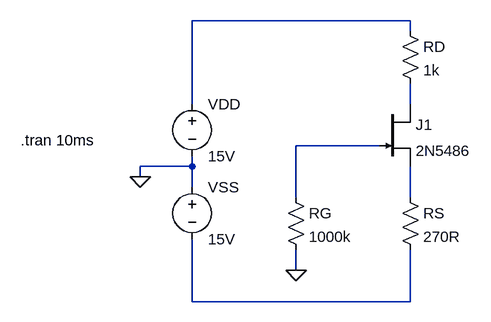
[diagram p0: schematic jfet-polarization-source-double.asc]
jfet-polarization-source-double.asc, the LTspice schematic file:
Version 4
SHEET 1 880 680
WIRE 240 -32 -96 -32
WIRE 240 -16 240 -32
WIRE -96 96 -96 -32
WIRE 240 96 240 64
WIRE 192 160 64 160
WIRE -96 192 -96 176
WIRE -96 192 -176 192
WIRE -176 208 -176 192
WIRE -96 224 -96 192
WIRE 64 240 64 160
WIRE 240 240 240 192
WIRE 64 352 64 320
WIRE -96 400 -96 304
WIRE 240 400 240 320
WIRE 240 400 -96 400
FLAG -176 208 0
FLAG 64 352 0
SYMBOL njf 192 96 R0
SYMATTR InstName J1
SYMATTR Value 2N5486
SYMBOL res 224 224 R0
SYMATTR InstName RS
SYMATTR Value 270R
SYMBOL res 224 -32 R0
SYMATTR InstName RD
SYMATTR Value 1k
SYMBOL res 48 224 R0
SYMATTR InstName RG
SYMATTR Value 1000k
SYMBOL voltage -96 208 R0
WINDOW 123 0 0 Left 0
WINDOW 39 0 0 Left 0
SYMATTR InstName VSS
SYMATTR Value 15V
SYMBOL voltage -96 80 R0
WINDOW 123 0 0 Left 0
WINDOW 39 0 0 Left 0
SYMATTR InstName VDD
SYMATTR Value 15V
TEXT -360 152 Left 2 !.tran 10ms

The netlist it stands for:
* jfet-polarization-source-double.asc
J1 N002 N003 N004 2N5486
RS N004 N005 270R
RD N001 N002 1k
RG N003 0 1000k
VSS 0 N005 15V
VDD N001 0 15V
.model NJF NJF
.model PJF PJF
.lib standard.jft
.tran 10ms
.backanno
.end